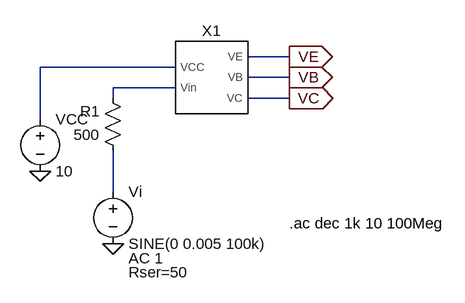
[diagram p0: schematic dp1_rin_testbench.asc]
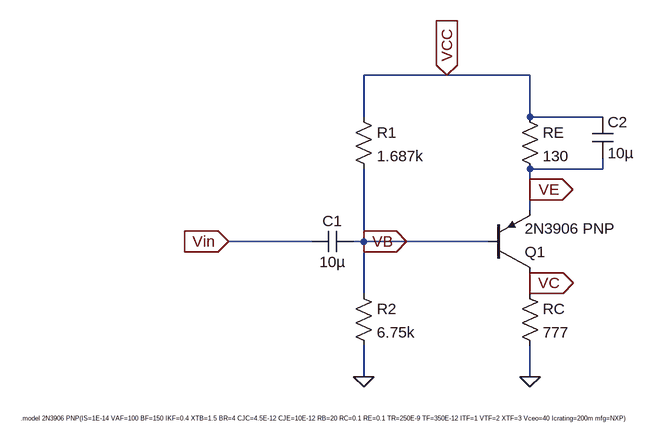
[diagram p1: sub-circuit ce_pnp_q2.asc]
dp1_rin_testbench.asc, the LTspice schematic file:
Version 4
SHEET 1 2800 1584
WIRE 288 240 224 240
WIRE 112 256 -96 256
WIRE 288 272 224 272
WIRE 112 288 16 288
WIRE 16 304 16 288
WIRE 288 304 224 304
WIRE -96 336 -96 256
WIRE 16 448 16 384
FLAG -96 416 0
FLAG 16 528 0
FLAG 288 304 VC
IOPIN 288 304 Out
FLAG 288 240 VE
IOPIN 288 240 Out
FLAG 288 272 VB
IOPIN 288 272 Out
SYMBOL voltage -96 320 R0
SYMATTR InstName VCC
SYMATTR Value 10
SYMBOL voltage 16 432 R0
WINDOW 123 24 118 Left 2
WINDOW 39 24 140 Left 2
SYMATTR Value2 AC 1
SYMATTR SpiceLine Rser=50
SYMATTR InstName Vi
SYMATTR Value SINE(0 0.005 100k)
SYMBOL Res 32 400 R180
WINDOW 0 36 76 Left 2
WINDOW 3 36 40 Left 2
SYMATTR InstName R1
SYMATTR Value 500
SYMBOL CE_pnp_Q2 160 272 R0
SYMATTR InstName X1
TEXT 288 496 Left 2 !.ac dec 1k 10 100Meg

ce_pnp_q2.asc, the sub-circuit schematic file:
Version 4
SHEET 1 2152 808
WIRE 608 96 480 96
WIRE 736 96 608 96
WIRE 480 160 480 96
WIRE 736 160 736 96
WIRE 848 160 736 160
WIRE 848 240 848 224
WIRE 848 240 736 240
WIRE 736 272 736 240
WIRE 736 304 736 272
WIRE 400 352 272 352
WIRE 480 352 480 240
WIRE 480 352 464 352
WIRE 672 352 480 352
WIRE 736 416 736 400
WIRE 480 432 480 352
WIRE 736 432 736 416
WIRE 480 560 480 512
WIRE 736 560 736 512
FLAG 480 560 0
FLAG 736 560 0
FLAG 608 96 VCC
IOPIN 608 96 In
FLAG 272 352 Vin
IOPIN 272 352 In
FLAG 480 352 VB
IOPIN 480 352 Out
FLAG 736 416 VC
IOPIN 736 416 Out
FLAG 736 272 VE
IOPIN 736 272 Out
SYMBOL Res 464 144 R0
SYMATTR InstName R1
SYMATTR Value 1.687k
SYMBOL Res 464 416 R0
SYMATTR InstName R2
SYMATTR Value 6.75k
SYMBOL Res 720 144 R0
SYMATTR InstName RE
SYMATTR Value 130
SYMBOL Cap 464 336 R90
WINDOW 0 0 32 VBottom 2
WINDOW 3 32 32 VTop 2
SYMATTR InstName C1
SYMATTR Value 10µ
SYMBOL pnp 672 400 M180
SYMATTR InstName Q1
SYMATTR Value 2N3906 PNP
SYMBOL Res 720 416 R0
SYMATTR InstName RC
SYMATTR Value 777
SYMBOL Cap 832 160 R0
SYMATTR InstName C2
SYMATTR Value 10µ
TEXT -48 624 Left 0 !.model 2N3906 PNP(IS=1E-14 VAF=100 BF=150 IKF=0.4 XTB=1.5 BR=4 CJC=4.5E-12 CJE=10E-12 RB=20 RC=0.1 RE=0.1 TR=250E-9 TF=350E-12 ITF=1 VTF=2 XTF=3 Vceo=40 Icrating=200m mfg=NXP)

The netlist it stands for:
* dp1_rin_testbench.asc
VCC N001 0 10
Vi N003 0 SINE(0 0.005 100k) AC 1 Rser=50
R1 N003 N002 500
XX1 N001 N002 VB VC VE ce_pnp_q2

* block symbol definitions
.subckt ce_pnp_q2 VCC Vin VB VC VE
R1 VCC VB 1.687k
R2 VB 0 6.75k
RE VCC VE 130
C1 VB Vin 10µ
Q1 VC VB VE 0 2N3906 PNP
RC VC 0 777
C2 VCC VE 10µ
.model 2N3906 PNP(IS=1E-14 VAF=100 BF=150 IKF=0.4 XTB=1.5 BR=4 CJC=4.5E-12 CJE=10E-12 RB=20 RC=0.1 RE=0.1 TR=250E-9 TF=350E-12 ITF=1 VTF=2 XTF=3 Vceo=40 Icrating=200m mfg=NXP)
.ends ce_pnp_q2

.model NPN NPN
.model PNP PNP
.lib standard.bjt
.ac dec 1k 10 100Meg
.backanno
.end